# Altium schematic sheet can_driver.SchDoc: =GlobalProjectName
size 209 x 297 mm; SheetNumber: 6; SheetTotal: 6; PageSetup: Record=PageOptions|CenterHorizontal=True|CenterVertical=True|PrintScale=1.00|XCorrection=1.00|YCorrection=1.00|PrintKind=1|BorderSize=5000000|LeftOffset=0|BottomOffset=0|Orientation=2|PaperLength=1000|PaperWidth=1000|Scale=100|PaperSource=15|PrintQuality=1200|MediaType=1|DitherType=10|PaperKind=A3|PrintScaleMode=1; Weight: -; ScaleFactor: -
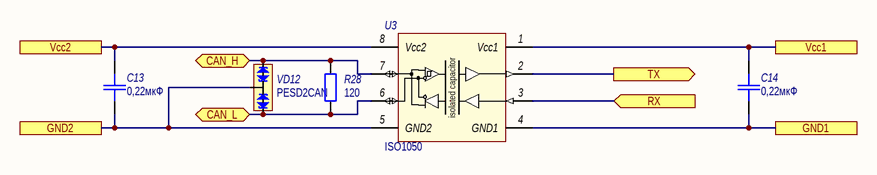
[diagram p0: can_driver.SchDoc]

## Parts
C13  0,22мкФ  [SMD_0805]
C14  0,22мкФ  [SMD_0805]
R28  120  [SMD_0805]
U3  ISO1050  [SOP-8]
VD12  PESD2CAN  [SOT-23]

## Ports
CAN_H (bidir), CAN_L (bidir), GND1, GND2, RX (in), TX (out), Vcc1, Vcc2

## Nets
CAN_H: R28.2 U3.7(ch) VD12.1(C1) ; port CAN_H
CAN_L: R28.1 U3.6(cl) VD12.2(C2) ; port CAN_L
GND1: C14.1 U3.4(GND1) ; port GND1
GND2: C13.1 U3.5(GND2) VD12.3(CC) ; port GND2
RX: U3.3(TXD) ; port RX
TX: U3.2(RXD) ; port TX
Vcc1: C14.2 U3.1(Vcc1) ; port Vcc1
Vcc2: C13.2 U3.8(Vcc2) ; port Vcc2

## Notes on the sheet
- Подп. и дата
- Инв. № дубл.
- Взам. инв. №
- Инв. № подл.
- Изм.
- Лист
- № докум.
- Подп.
- Дата
- Форма 2а ГОСТ 2.104-2006
- Копировал
- Формат А4
- (in symbol ISO1050) isolated capacitor

## Library data of the parts
C13 C14 = Capacitor: Назначение: SMD-конденсатор; Наименование: Конденсатор; Потребление, Вт: 0; Value: 0,22мкФ
R28 = Resistor: Наименование: Резистор; Назначение: SMD-резистор; Потребление, Вт: 0,001; Value: 120
U3 = ISO1050: Isolated CAN Transceiver; Назначение: Изолированный CAN приемник; Потребление, Вт: 0,001; ComponentLink1Description: Datasheet; ComponentLink1URL: http://www.ti.com/lit/ds/symlink/iso1050.pdf; Наименование: ISO1050
VD12 = PESD2CAN: CAN bus ESD protection diode; Назначение: Защитная диодная сборка CAN-шины от ЭСР; Потребление, Вт: 0,001; ComponentLink1Description: DataSheet; ComponentLink1URL: https://docviewer.yandex.ru/view/20572601/?*=RQqn8Wj9g8uNyA%2Fh5vLXNATrwhl7InVybCI6Imh0dHBzOi8vYXNzZXRzLm5leHBlcmlhLmNvbS9kb2N1bWVudHMvZGF0YS1zaGVldC9QRVNEMkNBTi5wZGYiLCJ0aXRsZSI6IlBFU0QyQ0FOLnBkZiIsIm5vaWZyYW1lIjp0cnVlLCJ1aWQiOiIyMDU3MjYwMSIsInRzIjoxNTk2Nzk0OTE4Njc4LCJ5dSI6Ijg4OTA2MTMzMTU0MzM4NzEyMSIsInNlcnBQYXJhbXMiOiJsYW5nPWVuJnRtPTE1OTY3OTQ4OTAmdGxkPXJ1Jm5hbWU9UEVTRDJDQU4ucGRmJnRleHQ9cGVzZDJjYW4mdXJsPWh0dHBzJTNBLy9hc3NldHMubmV4cGVyaWEuY29tL2RvY3VtZW50cy9kYXRhLXNoZWV0L1BFU0QyQ0FOLnBkZiZscj02NSZtaW1lPXBkZiZsMTBuPXJ1JnNpZ249MzE3ZjE4NzU1MTcwMWNmYmI4ZDQxYzc2OTNlYTFkYzIma2V5bm89MCJ9&lang=en; Наименование: PESD2CAN